# EasyEDA Pro project stm32_无人机.eprj, board PCB2
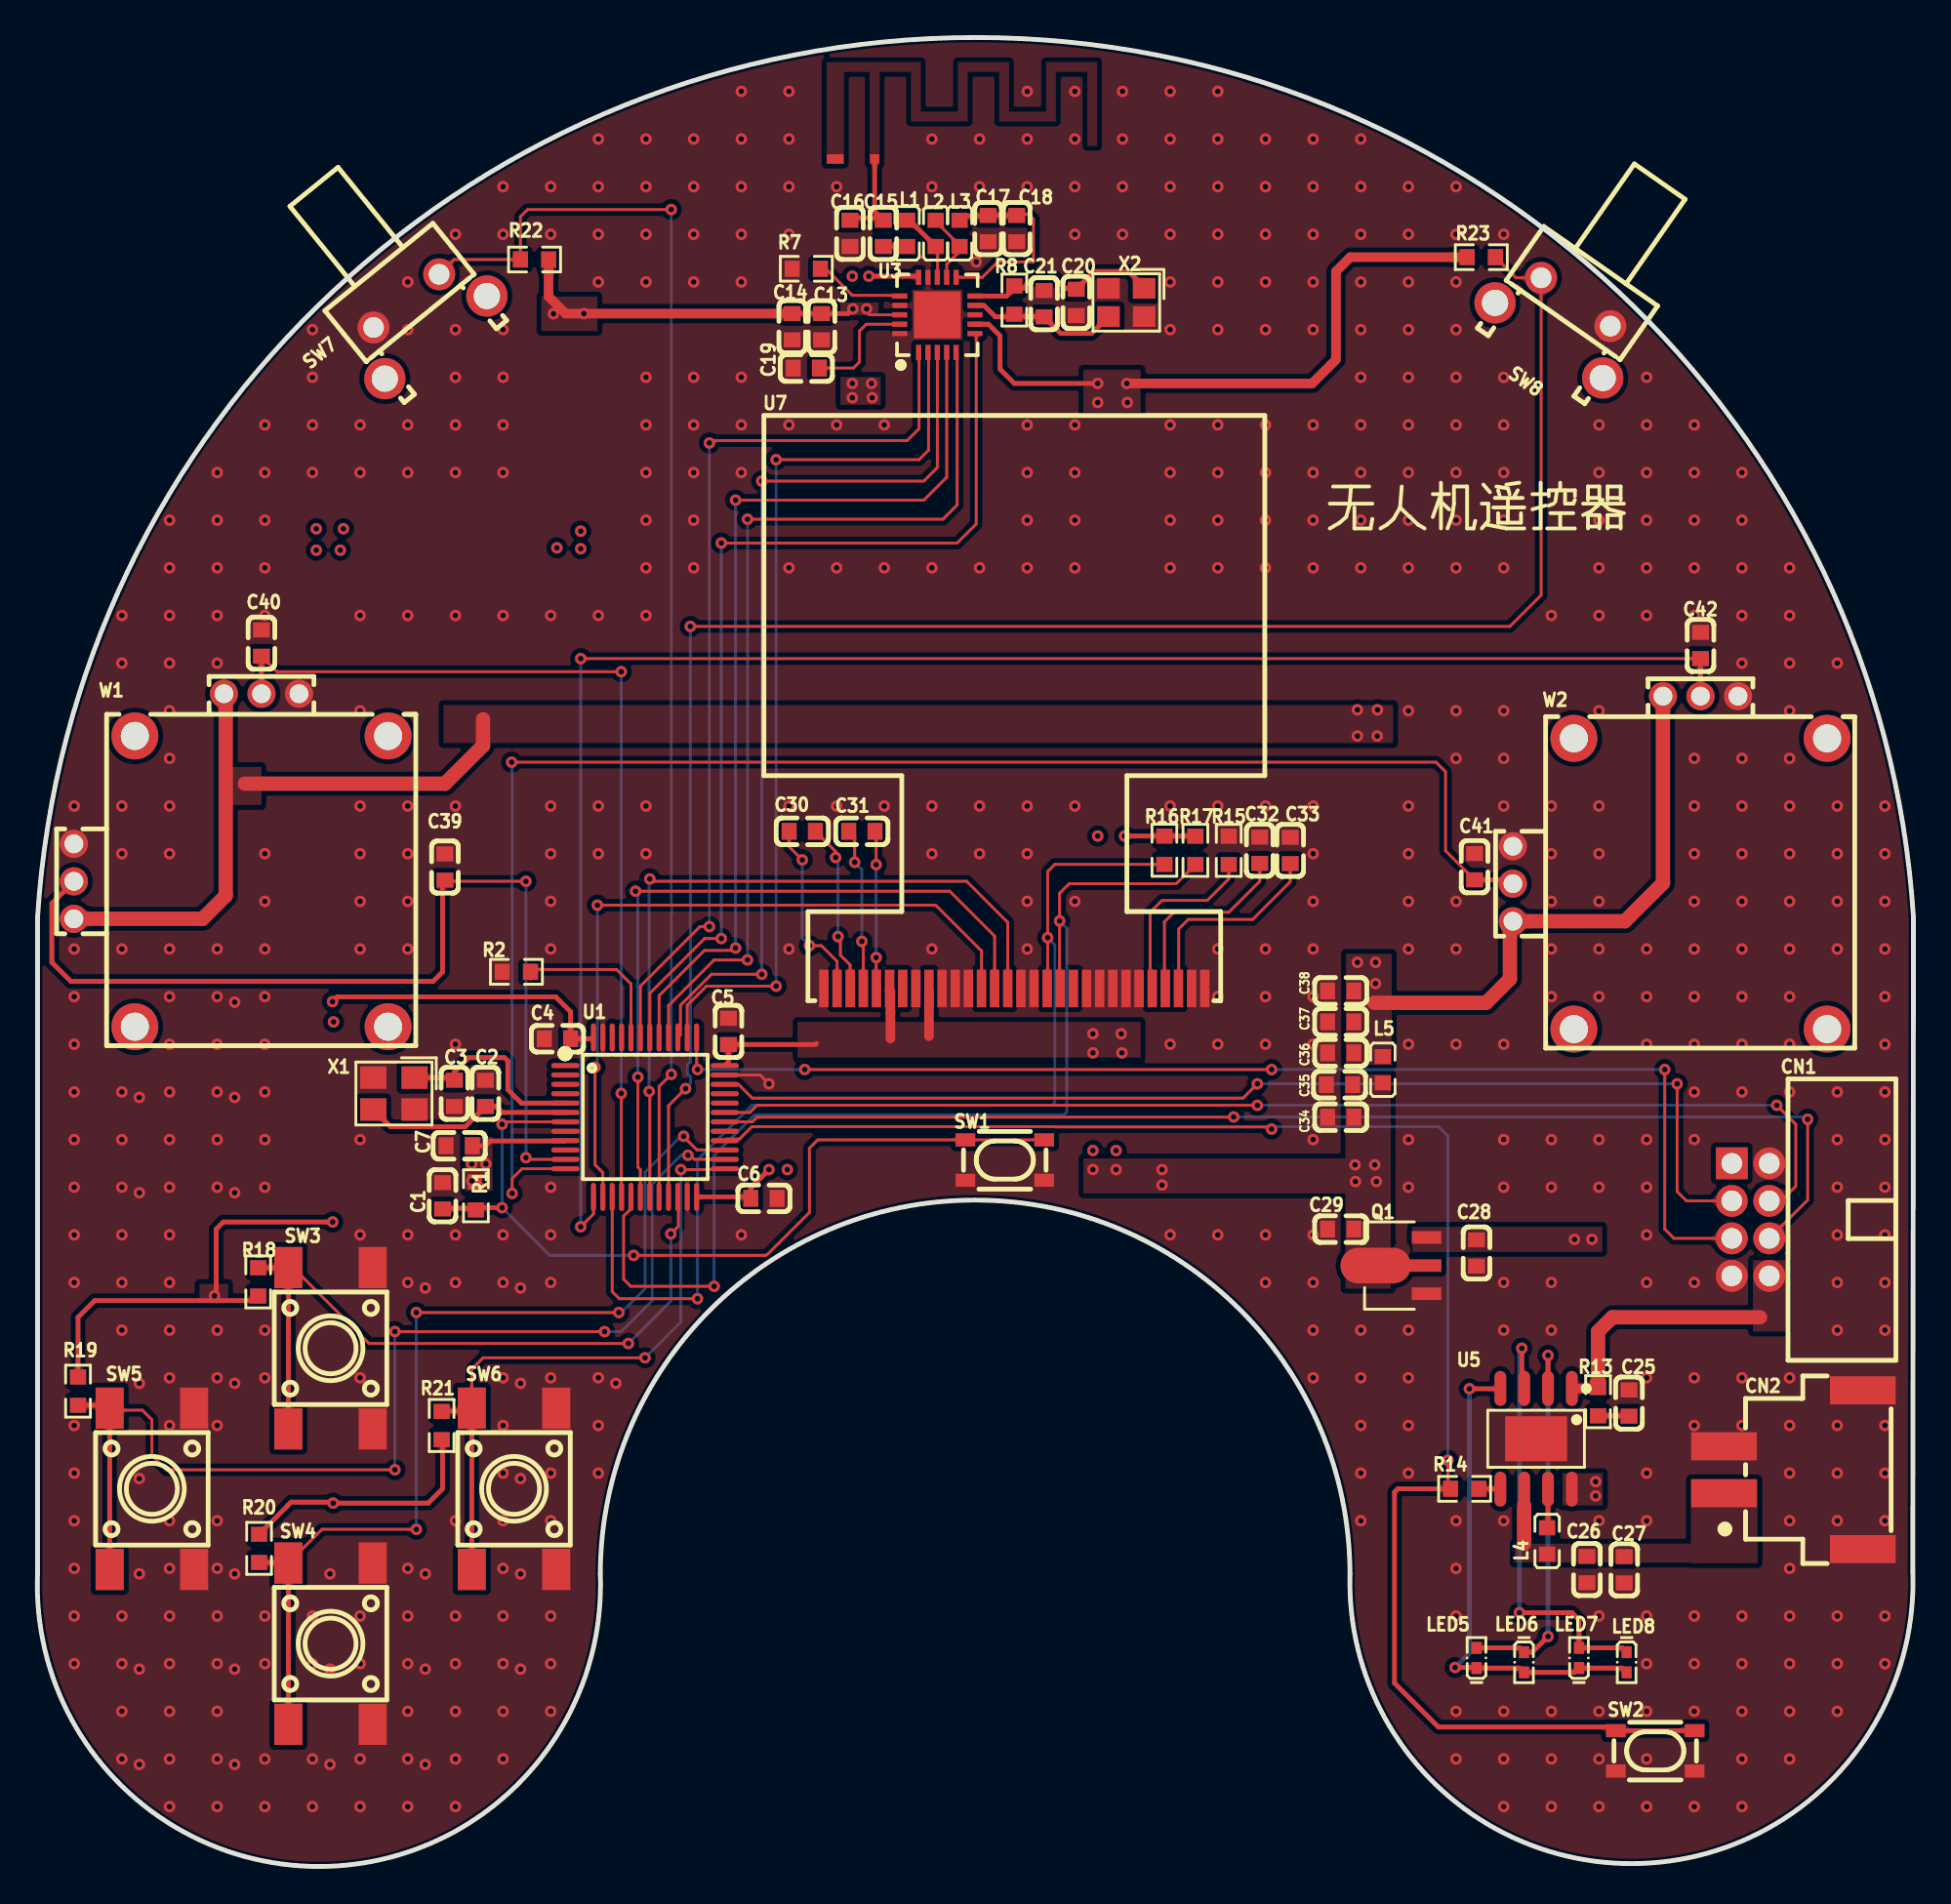
[diagram p13: board, top side]
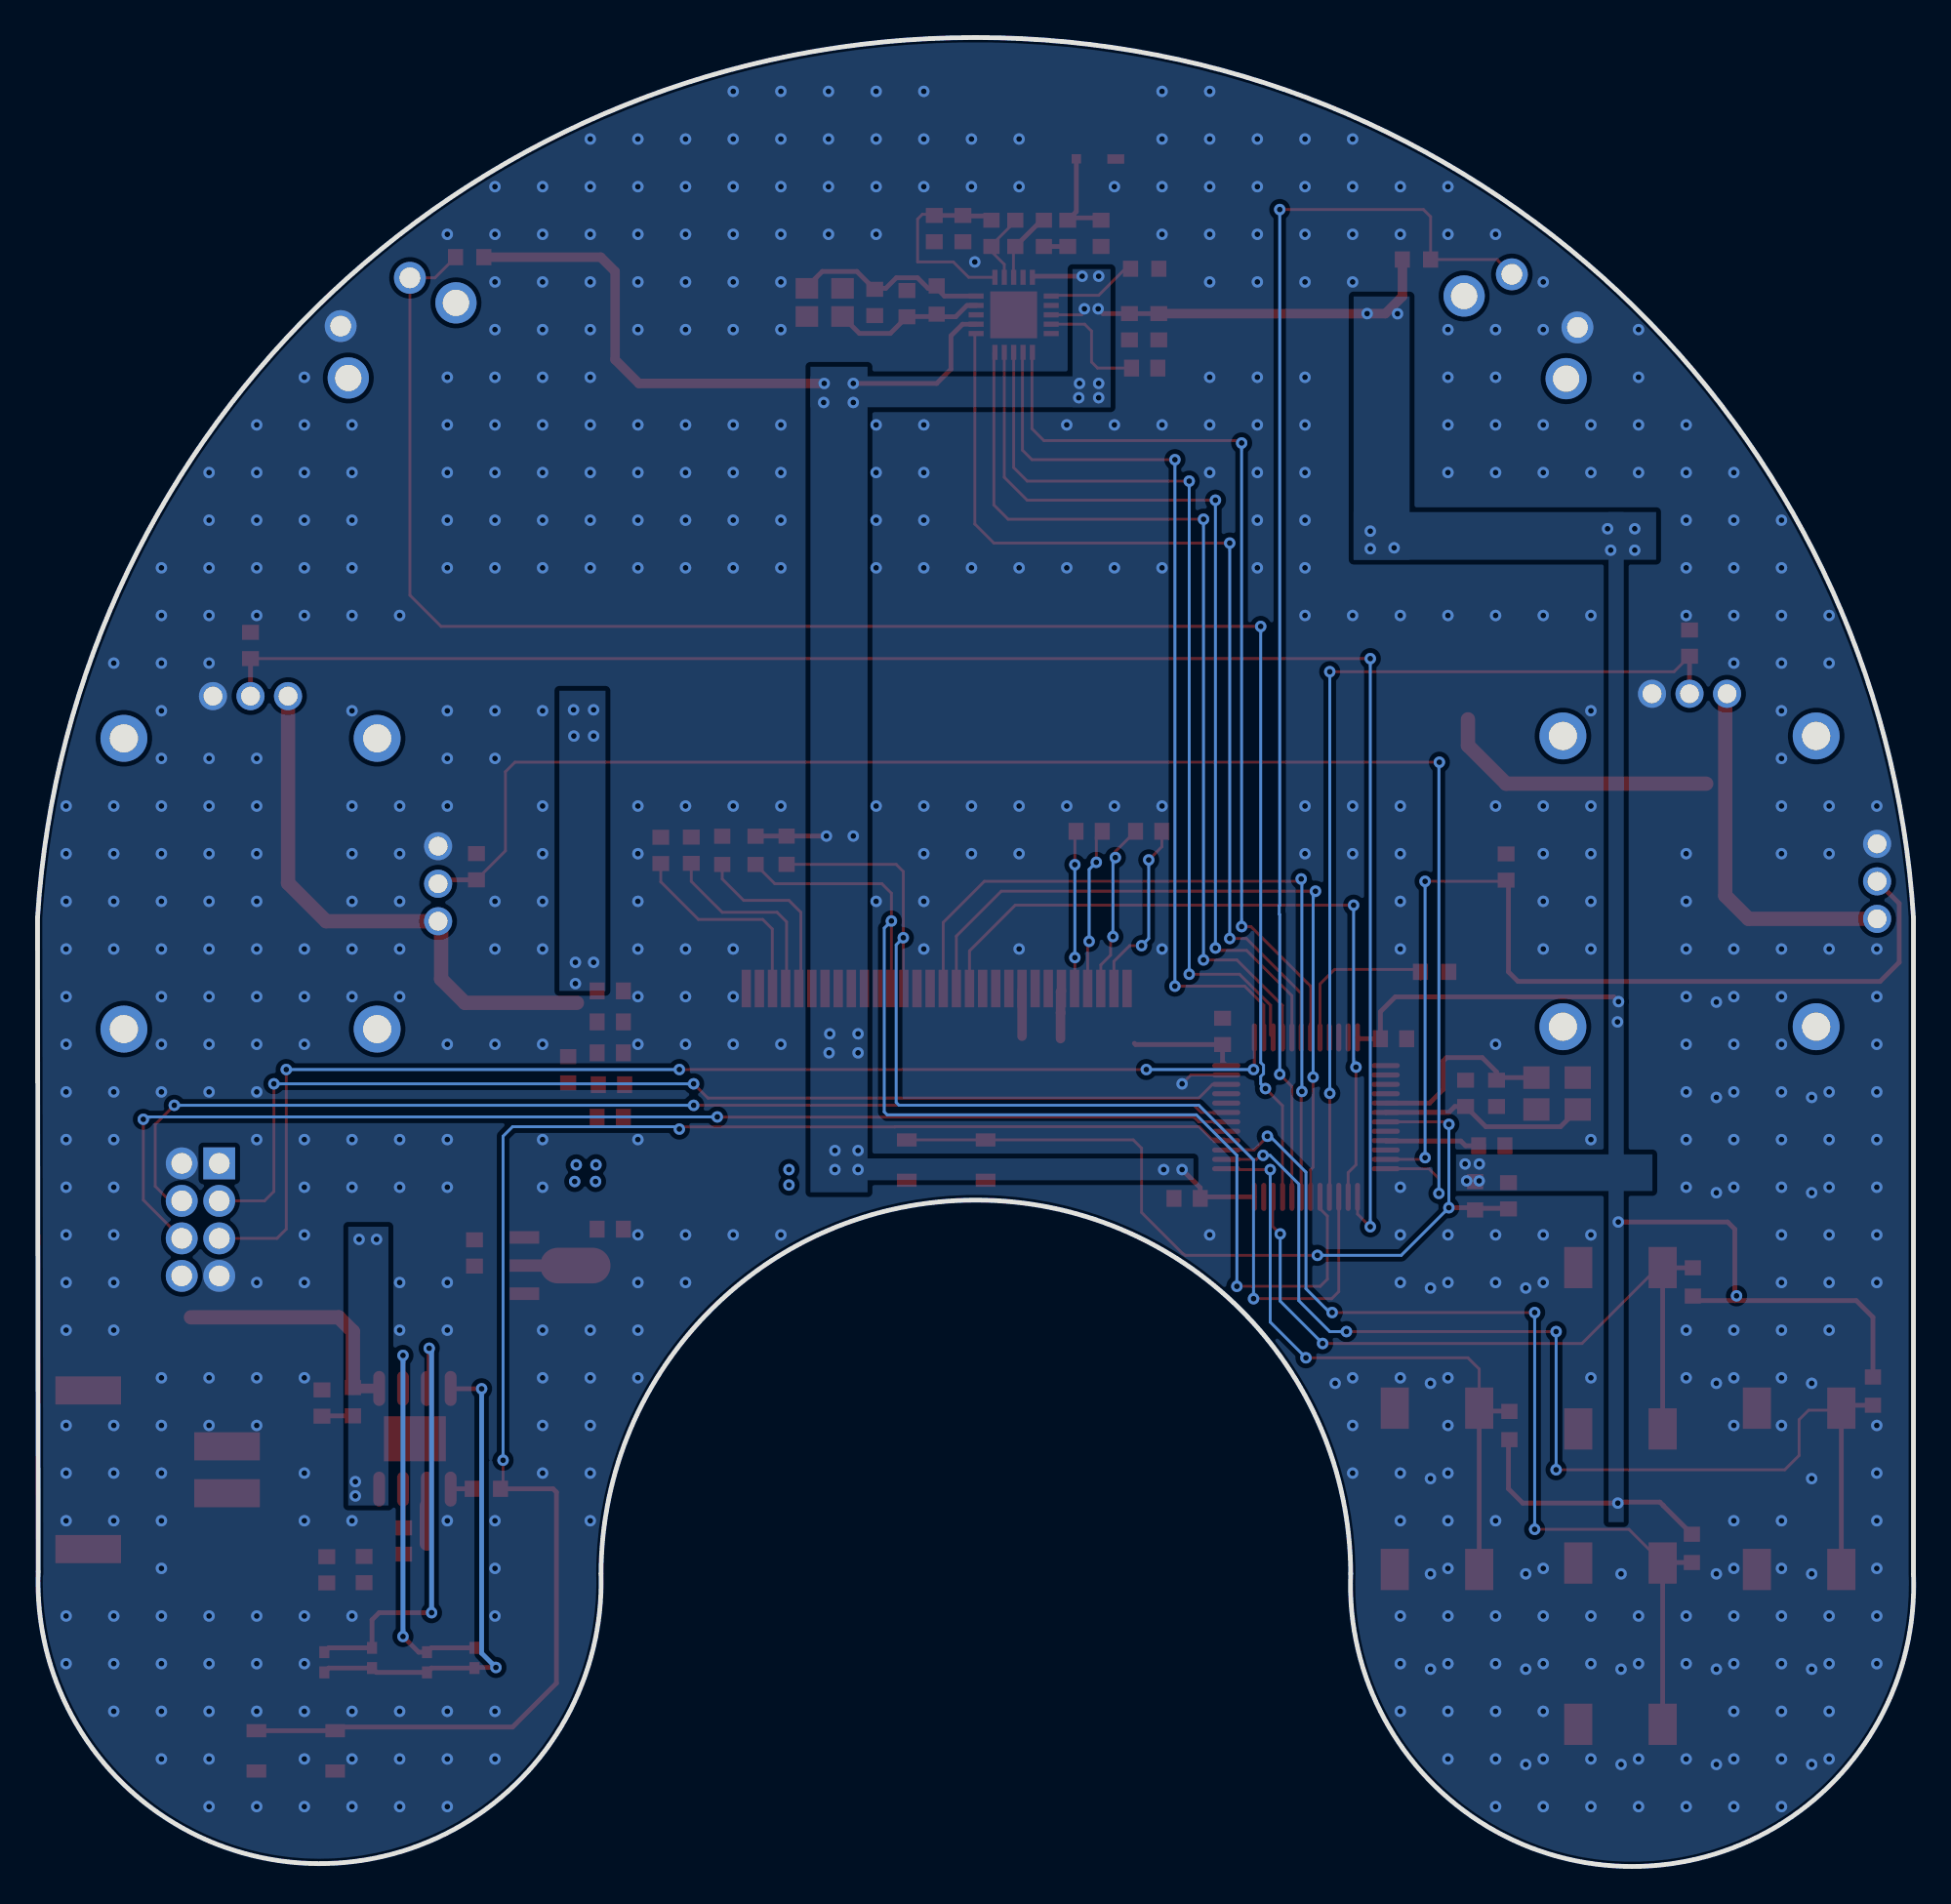
[diagram p14: board, bottom side, seen from below]

Outline 100 x 97.5 mm; copper layers: Top Layer, Bottom Layer. Coordinates in mm from the lower left corner of the outline.
Outline path: 0,50.58 0,15.58 arc(15,0) 30,15.61 arc(50.06,35.54) 69.96,15.61 arc(84.96,0.15) 99.96,15.73 100,50.58 arc(50,97.5) 0,50.58
Stack: Top Layer 0.035mm / Dielectric1 1.51mm FR4 er 4.5 / Bottom Layer 0.035mm

## Design rules (mm)
template: 自定义配置
spacing copperThickness1oz (default): track to track 0.102, other pairs 0.152 to 0.3
spacing copperThickness2oz: track to track 0.203, other pairs 0.152 to 0.3
track width copperThickness1oz (default): min 0.127, default 0.152, max 2.54
track width copperThickness2oz: min 0.203, default 0.254, max 2.54
differential pair differentialPair (default): width min 0.127, default 0.254, max 2.54; gap min 0.152, default 0.152
via viaSize (default): diameter min 0.5, default 0.61, max 10; hole min 0.3, default 0.305, max 6.3

## Placement (name value [footprint] x y rotation side)
C1  100nF  [C0603]  21.59 35.75 270 top
C2  12pF  [C0603]  23.88 41.22 270 top
C3  12pF  [C0603]  22.23 41.22 270 top
C4  100nF  [C0603]  27.72 44.13 0 top
C5  100nF  [C0603]  36.83 44.52 270 top
C6  100nF  [C0603]  38.72 35.62 180 top
C7  100nF  [C0603]  22.48 38.42 0 top
C13  100nF  [C0603]  41.79 82.08 90 top
C14  10uF  [C0603]  40.23 82.08 90 top
C15  1.5pF  [C0603]  45.08 87.06 90 top
C16  1pF  [C0603]  43.31 87.06 90 top
C17  4.7pF  [C0603]  50.67 87.32 90 top
C18  2.2nF  [C0603]  52.2 87.32 90 top
C19  33nF  [C0603]  40.98 79.88 0 top
C20  22pF  [C0603]  55.37 83.38 270 top
C21  22pF  [C0603]  53.66 83.31 270 top
C25  2.2uF  [C0603]  84.84 24.71 90 top
C26  10uF  [C0603]  82.59 15.83 90 top
C27  10uF  [C0603]  84.58 15.82 90 top
C28  10uF  [C0603]  76.71 32.71 90 top
C29  10uF  [C0603]  69.47 33.98 180 top
C30  1uF  [C0603]  40.77 55.19 180 top
C31  1uF  [C0603]  43.94 55.19 0 top
C32  4.7uF  [C0603]  65.15 54.18 270 top
C33  2.2uF  [C0603]  66.77 54.17 270 top
C34  10uF  [C0603]  69.47 39.95 0 top
C35  100nF  [C0603]  69.41 41.68 0 top
C36  1nF  [C0603]  69.47 43.37 0 top
C37  100nF  [C0603]  69.47 45.03 0 top
C38  10uF  [C0603]  69.47 46.68 0 top
C39  100nF  [C0603]  21.72 53.28 270 top
C40  100nF  [C0603]  11.94 65.22 270 top
C41  100nF  [C0603]  76.6 53.3 270 top
C42  100nF  [C0603]  88.65 65.09 270 top
CN1  3111-08RG0BK00T1  [CONN-TH_3111-08RG0BK00T1]  91.31 34.48 270 top
CN2  ZX-XH2.54-2PWT  [CONN-SMD_2P-P2.54_MEGASTAR_ZX-XH2.54-2PWT]  93.6 21.15 90 top
L1  3.9nH  [L0603]  46.36 87.06 270 top
L2  8.2nH  [L0603]  47.88 87.06 270 top
L3  2.7nH  [L0603]  49.15 87.06 90 top
L4  1.5uH  [L0603]  80.47 17.35 270 top
L5  10uH  [L0603]  71.71 42.47 270 top
LED5  XL-1005UYC  [LED0402-FD_YELLOW]  76.71 11.12 270 top
LED6  XL-1005UYC  [LED0402-FD_YELLOW]  79.24 10.89 90 top
LED7  XL-1005UYC  [LED0402-FD_YELLOW]  82.17 11.12 270 top
LED8  XL-1005UYC  [LED0402-FD_YELLOW]  84.71 10.89 90 top
NOREF  -  [Pad_e87]  44.63 91.03 0 top
NOREF#2  -  [Pad_e86]  42.52 91.03 0 top
Q1  AMS1117-3.3V  [SOT-89-3_L4.5-W2.5-P1.50-LS4.2-BR]  72.69 32.03 0 top
R1  10KΩ  [R0603]  23.37 35.75 90 top
R2  10K  [R0603]  25.53 47.69 180 top
R7  22K  [R0603]  40.98 85.17 180 top
R8  1MΩ  [R0603]  52.07 83.51 90 top
R13  1.5Ω  [R0603]  83.19 24.78 270 top
R14  10KΩ  [R0603]  76.07 20.13 180 top
R15  910Ω  [R0603]  63.5 54.17 270 top
R16  10K  [R0603]  60.07 54.18 270 top
R17  10K  [R0603]  61.72 54.17 270 top
R18  10K  [R0603]  11.76 31.16 90 top
R19  10K  [R0603]  2.16 25.34 270 top
R20  10K  [R0603]  11.81 16.96 270 top
R21  10K  [R0603]  21.54 23.51 90 top
R22  10K  [R0603]  26.49 85.67 180 top
R23  10K  [R0603]  76.96 85.79 0 top
SW1  SKRPACE010  [KEY-SMD_4P-L4.2-W3.2-P2.20-LS4.6]  51.56 37.66 0 top
SW2  SKRPACE010  [KEY-SMD_4P-L4.2-W3.2-P2.20-LS4.6]  86.23 6.16 0 top
SW3  TS-1102S-C-M-B  [KEY-SMD_4P-L6.0-W6.0-P4.50-LS8.6_TS-1102S-C-M-B]  15.62 27.63 90 top
SW4  TS-1102S-C-M-B  [KEY-SMD_4P-L6.0-W6.0-P4.50-LS8.6_TS-1102S-C-M-B]  15.62 11.88 90 top
SW5  TS-1102S-C-M-B  [KEY-SMD_4P-L6.0-W6.0-P4.50-LS8.6_TS-1102S-C-M-B]  6.1 20.13 90 top
SW6  TS-1102S-C-M-B  [KEY-SMD_4P-L6.0-W6.0-P4.50-LS8.6_TS-1102S-C-M-B]  25.4 20.13 90 top
SW7  UK-B02124G90-AQ25Y  [SW-TH_UK-B02124G90-AQ25Y]  20.45 82.49 219 top
SW8  UK-B02124G90-AQ25Y  [SW-TH_UK-B02124G90-AQ25Y]  81.28 82.38 145.1 top
U1  STM32F103C8T6  [LQFP-48_L7.0-W7.0-P0.50-LS9.0-BL]  32.39 39.95 270 top
U3  Si24R1  [QFN-20_L4.0-W4.0-P0.50-BL-EP]  47.97 82.72 0 top
U5  TP4336  [ESOP-8_L4.9-W3.9-P1.27-LS6.0-BL-EP-1]  79.88 22.8 180 top
U7  X096-2864KSWAG01-H30  [LCD-SMD_X096-2864KSWAG01-H30]  52.07 46.8 0 top
W1  -  [16*16双路]  11.94 52.52 0 top
W2  -  [16*16双路]  88.65 52.39 0 top
X1  8MHz  [CRYSTAL-SMD_4P-L3.2-W2.5-BL]  19 41.21 180 top
X2  -  [CRYSTAL-SMD_4P-L2.5-W2.0-BL-2]  58.04 83.38 180 top

## Footprints (pads in the part's own frame, mm; a bottom-side part is the same pattern mirrored in y, then rotated)
16*16双路
  round 1.5 hole 1: 1(-10,2) 2(-10,0) 3(-10,-2) 4(-2,10) 5(0,10) 6(2,10)
  round 2.5 hole 1.5: 7(-6.75,-7.75) 8(6.75,-7.75) 9(6.75,7.75) 10(-6.75,7.75)
C0603
  rect 0.8x0.9 smd: 1(-0.7,0) 2(0.7,0)
CONN-SMD_2P-P2.54_MEGASTAR_ZX-XH2.54-2PWT
  rect 1.5x3.5 smd: 1(-1.25,3.7) 2(1.25,3.7) 3(-4.23,-3.7) 4(4.23,-3.7)
CONN-TH_3111-08RG0BK00T1
  rect 1.7x1.7 hole 1.1: 1(-3,-1)
  round 1.7 hole 1.1: 2(-3,1) 3(-1,-1) 4(-1,1) 5(1,-1) 6(1,1) 7(3,-1) 8(3,1)
CRYSTAL-SMD_4P-L2.5-W2.0-BL-2
  rect 1.2x1.1 smd: 1(-0.95,-0.75) 2(0.95,-0.75) 3(0.95,0.75) 4(-0.95,0.75)
CRYSTAL-SMD_4P-L3.2-W2.5-BL
  rect 1.4x1.2 smd: 1(-1.1,-0.85) 2(1.1,-0.85) 3(1.1,0.85) 4(-1.1,0.85)
ESOP-8_L4.9-W3.9-P1.27-LS6.0-BL-EP-1
  oval 0.63x1.865 smd: 1(-1.905,-2.683) 2(-0.635,-2.683) 3(0.635,-2.683) 4(1.905,-2.683) 5(1.905,2.683) 6(0.635,2.683) 7(-0.635,2.683) 8(-1.905,2.683)
  rect 3.3x2.4 smd: 9(0,0)
KEY-SMD_4P-L4.2-W3.2-P2.20-LS4.6
  rect 1.05x0.7 smd: 1(-2.1,1.075) 2(2.1,1.075) 3(-2.1,-1.075) 4(2.1,-1.075)
KEY-SMD_4P-L6.0-W6.0-P4.50-LS8.6_TS-1102S-C-M-B
  rect 2.2x1.5 smd: 1(-4.3,2.25) 2(4.3,2.25) 3(-4.3,-2.25) 4(4.3,-2.25)
L0603
  rect 0.8x0.864 smd: 1(-0.7,0) 2(0.7,0)
LCD-SMD_X096-2864KSWAG01-H30
  rect 0.5x2 smd: 1(-10.15,0) 2(-9.45,0) 3(-8.75,0) 4(-8.05,0) 5(-7.35,0) 6(-6.65,0) 7(-5.95,0) 8(-5.25,0) 9(-4.55,0) 10(-3.85,0) 11(-3.15,0) 12(-2.45,0) 13(-1.75,0) 14(-1.05,0) 15(-0.35,0) 16(0.35,0) 17(1.05,0) 18(1.75,0) 19(2.45,0) 20(3.15,0) 21(3.85,0) 22(4.55,0) 23(5.25,0) 24(5.95,0) 25(6.65,0) 26(7.35,0) 27(8.05,0) 28(8.75,0) 29(9.45,0) 30(10.15,0)
LED0402-FD_YELLOW
  rect 0.636x0.54 smd: 1(-0.538,0) 2(0.538,0)
LQFP-48_L7.0-W7.0-P0.50-LS9.0-BL
  oval 0.27x1.5 smd: 1(-2.75,-4.25) 2(-2.25,-4.25) 3(-1.75,-4.25) 4(-1.25,-4.25) 5(-0.75,-4.25) 6(-0.25,-4.25) 7(0.25,-4.25) 8(0.75,-4.25) 9(1.25,-4.25) 10(1.75,-4.25) 11(2.25,-4.25) 12(2.75,-4.25) 25(2.75,4.25) 26(2.25,4.25) 27(1.75,4.25) 28(1.25,4.25) 29(0.75,4.25) 30(0.25,4.25) 31(-0.25,4.25) 32(-0.75,4.25) 33(-1.25,4.25) 34(-1.75,4.25) 35(-2.25,4.25) 36(-2.75,4.25)
  oval 1.5x0.27 smd: 13(4.25,-2.75) 14(4.25,-2.25) 15(4.25,-1.75) 16(4.25,-1.25) 17(4.25,-0.75) 18(4.25,-0.25) 19(4.25,0.25) 20(4.25,0.75) 21(4.25,1.25) 22(4.25,1.75) 23(4.25,2.25) 24(4.25,2.75) 37(-4.25,2.75) 38(-4.25,2.25) 39(-4.25,1.75) 40(-4.25,1.25) 41(-4.25,0.75) 42(-4.25,0.25) 43(-4.25,-0.25) 44(-4.25,-0.75) 45(-4.25,-1.25) 46(-4.25,-1.75) 47(-4.25,-2.25) 48(-4.25,-2.75)
Pad_e86
  rect 0.9x0.5 smd: 2(0,0)
Pad_e87
  rect 0.5x0.5 smd: 1(0,0)
QFN-20_L4.0-W4.0-P0.50-BL-EP
  rect 0.28x0.8 smd: 1(-1,-2) 2(-0.5,-2) 3(0,-2) 4(0.5,-2) 5(1,-2) 11(1,2) 12(0.5,2) 13(0,2) 14(-0.5,2) 15(-1,2)
  rect 0.8x0.28 smd: 6(2,-1) 7(2,-0.5) 8(2,0) 9(2,0.5) 10(2,1) 16(-2,1) 17(-2,0.5) 18(-2,0) 19(-2,-0.5) 20(-2,-1)
  rect 2.5x2.5 smd: 21(0,0)
R0603
  rect 0.806x0.864 smd: 1(-0.753,0) 2(0.753,0)
SOT-89-3_L4.5-W2.5-P1.50-LS4.2-BR
  rect 1.575x0.672 smd: 1(1.356,-1.5) 3(1.356,1.5)
  custom 5.377x1.9 smd: 2(-1.356,0)
SW-TH_UK-B02124G90-AQ25Y
  round 1.7 hole 1.1: 1(-2.25,-1.25) 2(2.25,-1.25)
  round 2.2 hole 1.4: 3(-3.5,1.25) 4(3.5,1.25)

## Nets
As in the schematic, except:
AT1: C15.2 C16.2 NOREF.1 NOREF#2.2
$1N1208: R2.1 U1.44

Pads without a net: CN1 1; SW7 3 4; SW8 3 4; U1 1 2 3 4 10 29 32 33 45 46; U7 7 20; W1 7 8 9 10; W2 7 8 9 10

## Via types
v1: diameter 0.61, hole 0.305, Top Layer to Bottom Layer, 724 vias

## Routing (per net, layer and track width the routed paths; a pad name or vN(x,y) marks a point on that pad's centre or on a via; arc(x,y) is an arc through that point)
3V3: length 133.2
  Top Layer w0.152: U3.18 44.32,82.72
  Top Layer w0.254: R19.1 2.16,29.28 3.05,30.17 9.53,30.17 ; 9.53,30.17 11.52,30.17 R18.1 ; 9.53,30.17 9.53,33.98 9.91,34.36 v1(15.74,34.36) ; C14.2 C13.2 43.21,82.78 v1(43.46,83.04) ; U1.24 37.94,35.7 C6.2 38.02,36.18 v1(38.99,37.15) ; R17.1 61.72,54.93 R16.1 ; U3.7 50.69,82.22 51.31,81.6 51.31,79.82 52.07,79.06 v1(56.52,79.06) ; U1.36 36.83,42.89 C5.2 41.46,43.82 41.53,43.88 ; U1.48 29.57,44.13 C4.2 28.42,45.57 27.62,46.36 15.98,46.36 v1(15.72,46.11) ; v1(57.95,54.93) 60.07,54.93 ; v1(44.31,84.78) 46.91,84.78 U3.15 ; R20.1 13.34,19.24 13.34,19.24 13.51,19.42 15.71,19.42 v1(15.76,19.37) 20.83,19.37 21.59,20.13 21.59,22.71 R21.1 ; 22.93,38.42 23.88,38.42 24.13,38.68 28.12,38.68 U1.9
  Top Layer w0.508: 47.52,46.68 47.52,44.26 ; 45.42,46.68 45.46,46.63 45.46,45.51 45.47,45.51 45.47,44.14 ; C14.2 v1(29.12,82.78) 28.15,82.78 27.24,83.7 27.24,85.66 R22.1 ; R23.1 69.98,85.79 69.22,85.03 69.22,80.33 67.95,79.06 v1(58.07,79.06)
  vias: v1(9.43,30.42) v1(14.86,71.31) v1(14.86,70.17) v1(15.78,45.03) v1(16.14,70.17) v1(16.31,71.31) v1(23.14,37.45) v1(23.15,36.55) v1(23.9,37.45) v1(23.82,36.55) v1(27.5,82.78) v1(27.69,70.3) v1(28.96,71.19) v1(28.96,70.25) v1(39.97,37.15) v1(43.43,84.78) v1(43.43,79.06) v1(43.43,78.3) v1(44.2,83.04) v1(44.46,79.06) v1(44.5,78.3) v1(56.26,44.39) v1(56.26,43.37) v1(56.26,38.17) v1(56.26,37.15) v1(56.52,78.05) v1(56.52,54.93) v1(57.49,38.17) v1(57.49,37.15) v1(57.77,44.39) v1(57.81,43.37) v1(58.09,78.05) v1(59.94,37.15) v1(59.94,36.33) v1(70.23,37.41) v1(70.25,36.52) v1(71.28,37.41) v1(71.37,36.52)
3V3A: length 64.1
  Top Layer w0.762: W1.3 8.8,50.52 10.03,51.76 10.03,62.52 10.03,62.52 W1.4 ; 11.05,57.73 21.72,57.73 23.75,59.76 23.75,61.15 ; W2.4 86.65,52.42 84.61,50.39 W2.3 78.49,50.23 78.49,47.31 77.22,46.04 71.25,46.04
  vias: v1(70.36,61.66) v1(70.36,60.27) v1(70.36,48.2) v1(71.33,48.2) v1(71.33,47.07) v1(71.43,61.66) v1(71.41,60.27)
+5V:
  vias: v1(81.93,33.43) v1(82.86,33.43) v1(83.06,20.52) v1(83.06,19.75)
GND: length 2.5
  Top Layer w0.152: U1.35 38.52,42.2 v1(38.99,41.72)
  vias: v1(1.96,56.53) v1(1.96,48.91) v1(1.96,46.37) v1(1.96,43.83) v1(1.96,41.29) v1(1.96,38.75) v1(1.96,36.21) v1(1.96,33.67) v1(1.96,31.13) v1(1.96,23.51) v1(1.96,20.97) v1(1.96,18.43) v1(1.96,15.89) v1(1.96,13.35) v1(1.96,10.81) v1(4.5,66.69) v1(4.5,64.15) v1(4.5,56.53) v1(4.5,53.99) v1(4.5,48.91) v1(4.5,41.29) v1(4.5,38.75) v1(4.5,36.21) v1(4.5,33.67) v1(4.5,31.13) v1(4.5,28.59) v1(4.5,13.35) v1(4.5,10.81) v1(4.5,8.27) v1(4.5,5.73) v1(5.43,41) v1(5.43,35.92) v1(5.43,25.76) v1(5.43,20.68) v1(5.43,15.6) v1(5.43,10.52) v1(5.43,5.44) v1(7.04,71.77) v1(7.04,69.23) v1(7.04,66.69) v1(7.04,64.15) v1(7.04,61.61) v1(7.04,59.07) v1(7.04,56.53) v1(7.04,53.99) v1(7.04,48.91) v1(7.04,46.37) v1(7.04,43.83) v1(7.04,41.29) v1(7.04,38.75) v1(7.04,36.21) v1(7.04,33.67) v1(7.04,31.13) v1(7.04,28.59) v1(7.04,26.05) v1(7.04,23.51) v1(7.04,18.43) v1(7.04,15.89) v1(7.04,13.35) v1(7.04,10.81) v1(7.04,8.27) v1(7.04,5.73) v1(7.04,3.19) v1(9.58,74.31) v1(9.58,71.77) v1(9.58,69.23) v1(9.58,66.69) v1(9.58,64.15) v1(9.58,48.91) v1(9.58,46.37) v1(9.58,43.83) v1(9.58,41.29) v1(9.58,38.75) v1(9.58,36.21) v1(9.58,28.59) v1(9.58,26.05) v1(9.58,23.51) v1(9.58,18.43) v1(9.58,15.89) v1(9.58,13.35) v1(9.58,10.81) v1(9.58,8.27) v1(9.58,5.73) v1(9.58,3.19) v1(10.51,46.08) v1(10.51,41) v1(10.51,35.92) v1(10.51,25.76) v1(10.51,15.6) v1(10.51,10.52) v1(10.51,5.44) v1(12.12,76.85) v1(12.12,74.31) v1(12.12,71.77) v1(12.12,69.23) v1(12.12,66.69) v1(12.12,53.99) v1(12.12,51.45) v1(12.12,48.91) v1(12.12,46.37) v1(12.12,43.83) v1(12.12,41.29) v1(12.12,38.75) v1(12.12,36.21) v1(12.12,28.59) v1(12.12,26.05) v1(12.12,13.35) v1(12.12,10.81) v1(12.12,5.73) v1(12.12,3.19) v1(14.66,81.93) v1(14.66,79.39) v1(14.66,76.85) v1(14.66,74.31) v1(14.66,13.35) v1(14.66,10.81) v1(14.66,5.73) v1(14.66,3.19) v1(15.59,15.6) v1(15.59,10.52) v1(15.59,5.44) v1(17.2,76.85) v1(17.2,74.31) v1(17.2,66.69) v1(17.2,61.61) v1(17.2,56.53) v1(17.2,53.99) v1(17.2,51.45) v1(17.2,48.91) v1(17.2,38.75) v1(17.2,33.67) v1(17.2,26.05) v1(17.2,13.35) v1(17.2,10.81) v1(17.2,5.73) v1(17.2,3.19) v1(19.74,84.47) v1(19.74,81.93) v1(19.74,76.85) v1(19.74,74.31) v1(19.74,66.69) v1(19.74,56.53) v1(19.74,53.99) v1(19.74,51.45) v1(19.74,48.91) v1(19.74,33.67) v1(19.74,31.13) v1(19.74,15.89) v1(19.74,13.35) v1(19.74,10.81) v1(19.74,8.27) v1(19.74,5.73) v1(19.74,3.19) v1(20.67,30.84) v1(20.67,15.6) v1(20.67,10.52) v1(20.67,5.44) v1(22.28,87.01) v1(22.28,81.93) v1(22.28,79.39) v1(22.28,76.85) v1(22.28,74.31) v1(22.28,66.69) v1(22.28,56.53) v1(22.28,43.83) v1(22.28,33.67) v1(22.28,31.13) v1(22.28,18.43) v1(22.28,13.35) v1(22.28,10.81) v1(22.28,8.27) v1(22.28,5.73) v1(22.28,3.19) v1(24.82,89.55) v1(24.82,87.01) v1(24.82,81.93) v1(24.82,79.39) v1(24.82,76.85) v1(24.82,74.31) v1(24.82,66.69) v1(24.82,33.67) v1(24.82,31.13) v1(24.82,26.05) v1(24.82,23.51) v1(24.82,20.97) v1(24.82,18.43) v1(24.82,15.89) v1(24.82,13.35) v1(24.82,10.81) v1(24.82,8.27) v1(24.82,5.73) v1(25.75,30.84) v1(25.75,25.76) v1(25.75,20.68) v1(25.75,15.6) v1(25.75,10.52) v1(27.36,89.55) v1(27.36,87.01) v1(27.36,66.69) v1(27.36,56.53) v1(27.36,53.99) v1(27.36,51.45) v1(27.36,48.91) v1(27.36,36.21) v1(27.36,33.67) v1(27.36,31.13) v1(27.36,26.05) v1(27.36,20.97) v1(27.36,18.43) v1(27.36,13.35) v1(27.36,10.81) v1(27.36,8.27) v1(29.9,92.09) v1(29.9,89.55) v1(29.9,87.01) v1(29.9,84.47) v1(29.9,66.69) v1(29.9,56.53) v1(29.9,53.99) v1(29.9,26.05) v1(29.9,23.51) v1(29.9,20.97) v1(30.83,25.76) v1(32.44,92.09) v1(32.44,89.55) v1(32.44,87.01) v1(32.44,84.47) v1(32.44,79.39) v1(32.44,76.85) v1(32.44,74.31) v1(32.44,71.77) v1(32.44,69.23) v1(32.44,66.69) v1(32.44,56.53) v1(32.44,53.99) v1(34.98,92.09) v1(34.98,89.55) v1(34.98,87.01) v1(34.98,84.47) v1(34.98,79.39) v1(34.98,76.85) v1(34.98,74.31) v1(34.98,71.77) v1(34.98,69.23) v1(37.52,94.63) v1(37.52,92.09) v1(37.52,89.55) v1(37.52,87.01) v1(37.52,84.47) v1(37.52,79.39) v1(37.52,76.85) v1(37.52,74.31) v1(37.52,33.67) v1(40.06,94.63) v1(40.06,92.09) v1(40.06,89.55) v1(40.06,87.01) v1(40.06,76.85) v1(40.06,69.23) v1(40.06,56.53) v1(40.06,48.91) v1(42.6,89.55) v1(42.6,76.85) v1(42.6,69.23) v1(42.6,56.53) v1(45.14,76.85) v1(45.14,69.23) v1(45.14,56.53) v1(47.68,92.09) v1(47.68,89.55) v1(47.68,69.23) v1(47.68,56.53) v1(47.68,53.99) v1(47.68,48.91) v1(50.04,85.54) v1(50.22,92.09) v1(50.22,89.55) v1(50.22,69.23) v1(50.22,56.53) v1(50.22,53.99) v1(52.76,94.63) v1(52.76,92.09) v1(52.76,89.55) v1(52.76,76.85) v1(52.76,74.31) v1(52.76,71.77) v1(52.76,69.23) v1(52.76,56.53) v1(52.76,53.99) v1(52.76,51.45) v1(52.76,48.91) v1(55.3,94.63) v1(55.3,92.09) v1(55.3,89.55) v1(55.3,87.01) v1(55.3,76.85) v1(55.3,74.31) v1(55.3,71.77) v1(55.3,69.23) v1(55.3,56.53) v1(55.3,51.45) v1(57.84,94.63) v1(57.84,92.09) v1(57.84,89.55) v1(57.84,87.01) v1(60.38,94.63) v1(60.38,92.09) v1(60.38,89.55) v1(60.38,87.01) v1(60.38,84.47) v1(60.38,81.93) v1(60.38,76.85) v1(60.38,74.31) v1(60.38,71.77) v1(60.38,69.23) v1(60.38,56.53) v1(60.38,43.83) v1(60.38,33.67) v1(62.92,94.63) v1(62.92,92.09) v1(62.92,89.55) v1(62.92,87.01) v1(62.92,84.47) v1(62.92,81.93) v1(62.92,76.85) v1(62.92,74.31) v1(62.92,71.77) v1(62.92,69.23) v1(62.92,56.53) v1(62.92,48.91) v1(62.92,46.37) v1(62.92,43.83) v1(62.92,33.67) v1(65.46,92.09) v1(65.46,89.55) v1(65.46,87.01) v1(65.46,84.47) v1(65.46,81.93) v1(65.46,76.85) v1(65.46,74.31) v1(65.46,71.77) v1(65.46,69.23) v1(65.46,56.53) v1(65.46,48.91) v1(65.46,46.37) v1(65.46,43.83) v1(65.46,33.67) v1(65.46,31.13) v1(68,92.09) v1(68,89.55) v1(68,87.01) v1(68,84.47) v1(68,81.93) v1(68,76.85) v1(68,74.31) v1(68,71.77) v1(68,69.23) v1(68,56.53) v1(68,53.99) v1(68,51.45) v1(68,48.91) v1(68,46.37) v1(68,43.83) v1(68,38.75) v1(68,33.67) v1(68,31.13) v1(68,28.59) v1(68,26.05) v1(70.54,92.09) v1(70.54,89.55) v1(70.54,87.01) v1(70.54,84.47) v1(70.54,81.93) v1(70.54,79.39) v1(70.54,76.85) v1(70.54,74.31) v1(70.54,71.77) v1(70.54,69.23) v1(70.54,28.59) v1(70.54,26.05) v1(70.54,23.51) v1(70.54,20.97) v1(70.54,18.43) v1(73.08,89.55) v1(73.08,87.01) v1(73.08,84.47) v1(73.08,81.93) v1(73.08,79.39) v1(73.08,76.85) v1(73.08,74.31) v1(73.08,71.77) v1(73.08,69.23) v1(73.08,61.61) v1(73.08,56.53) v1(73.08,53.99) v1(73.08,51.45) v1(73.08,48.91) v1(73.08,43.83) v1(73.08,38.75) v1(73.08,36.21) v1(73.08,28.59) v1(73.08,26.05) v1(73.08,23.51) v1(73.08,20.97) v1(75.62,89.55) v1(75.62,87.01) v1(75.62,84.47) v1(75.62,81.93) v1(75.62,79.39) v1(75.62,76.85) v1(75.62,74.31) v1(75.62,71.77) v1(75.62,69.23) v1(75.62,61.61) v1(75.62,59.07) v1(75.62,51.45) v1(75.62,48.91) v1(75.62,43.83) v1(75.62,18.43) v1(75.62,15.89) v1(75.62,13.35) v1(75.62,8.27) v1(75.62,5.73) v1(78.16,87.01) v1(78.16,79.39) v1(78.16,76.85) v1(78.16,74.31) v1(78.16,71.77) v1(78.16,69.23) v1(78.16,61.61) v1(78.16,59.07) v1(78.16,56.53) v1(78.16,43.83) v1(78.16,38.75) v1(78.16,36.21) v1(78.16,31.13) v1(78.16,28.59) v1(78.16,18.43) v1(78.16,8.27) v1(78.16,5.73) v1(78.16,3.19) v1(80.7,66.69) v1(80.7,56.53) v1(80.7,53.99) v1(80.7,51.45) v1(80.7,48.91) v1(80.7,46.37) v1(80.7,38.75) v1(80.7,36.21) v1(80.7,31.13) v1(80.7,28.59) v1(80.7,8.27) v1(80.7,5.73) v1(80.7,3.19) v1(83.24,76.85) v1(83.24,74.31) v1(83.24,71.77) v1(83.24,69.23) v1(83.24,66.69) v1(83.24,61.61) v1(83.24,56.53) v1(83.24,53.99) v1(83.24,51.45) v1(83.24,48.91) v1(83.24,46.37) v1(83.24,38.75) v1(83.24,36.21) v1(83.24,18.43) v1(83.24,13.35) v1(83.24,8.27) v1(83.24,5.73) v1(83.24,3.19) v1(85.78,79.39) v1(85.78,76.85) v1(85.78,74.31) v1(85.78,71.77) v1(85.78,69.23) v1(85.78,66.69) v1(85.78,48.91) v1(85.78,46.37) v1(85.78,43.83) v1(85.78,38.75) v1(85.78,36.21) v1(85.78,33.67) v1(85.78,31.13) v1(85.78,26.05) v1(85.78,20.97) v1(85.78,18.43) v1(85.78,13.35) v1(85.78,10.81) v1(85.78,8.27) v1(85.78,5.73) v1(85.78,3.19) v1(88.32,76.85) v1(88.32,74.31) v1(88.32,71.77) v1(88.32,69.23) v1(88.32,66.69) v1(88.32,59.07) v1(88.32,56.53) v1(88.32,53.99) v1(88.32,51.45) v1(88.32,48.91) v1(88.32,46.37) v1(88.32,43.83) v1(88.32,41.29) v1(88.32,38.75) v1(88.32,31.13) v1(88.32,26.05) v1(88.32,23.51) v1(88.32,13.35) v1(88.32,10.81) v1(88.32,8.27) v1(88.32,3.19) v1(90.86,74.31) v1(90.86,71.77) v1(90.86,69.23) v1(90.86,66.69) v1(90.86,64.15) v1(90.86,59.07) v1(90.86,56.53) v1(90.86,53.99) v1(90.86,51.45) v1(90.86,48.91) v1(90.86,46.37) v1(90.86,43.83) v1(90.86,41.29) v1(90.86,26.05) v1(90.86,23.51) v1(90.86,13.35) v1(90.86,10.81) v1(90.86,8.27) v1(90.86,5.73) v1(90.86,3.19) v1(93.4,69.23) v1(93.4,66.69) v1(93.4,64.15) v1(93.4,61.61) v1(93.4,59.07) v1(93.4,56.53) v1(93.4,53.99) v1(93.4,51.45) v1(93.4,48.91) v1(93.4,46.37) v1(93.4,43.83) v1(93.4,41.29) v1(93.4,26.05) v1(93.4,23.51) v1(93.4,20.97) v1(93.4,18.43) v1(93.4,15.89) v1(93.4,13.35) v1(93.4,10.81) v1(93.4,8.27) v1(93.4,5.73) v1(95.94,64.15) v1(95.94,56.53) v1(95.94,53.99) v1(95.94,51.45) v1(95.94,48.91) v1(95.94,41.29) v1(95.94,38.75) v1(95.94,36.21) v1(95.94,33.67) v1(95.94,31.13) v1(95.94,28.59) v1(95.94,23.51) v1(95.94,20.97) v1(95.94,18.43) v1(95.94,13.35) v1(95.94,10.81) v1(95.94,8.27) v1(98.48,56.53) v1(98.48,53.99) v1(98.48,51.45) v1(98.48,48.91) v1(98.48,46.37) v1(98.48,43.83) v1(98.48,41.29) v1(98.48,38.75) v1(98.48,36.21) v1(98.48,33.67) v1(98.48,31.13) v1(98.48,28.59) v1(98.48,23.51) v1(98.48,20.97) v1(98.48,18.43) v1(98.48,13.35) v1(98.48,10.81)
VBAT: length 2
  Top Layer w0.762: 79.25,19.23 79.25,17.21
VCC: length 13.4
  Top Layer w0.508: U5.1 83.14,25.48 R13.1
  Top Layer w0.762: R13.1 83.19,28.52 83.95,29.28 91.82,29.28
ADC1-1: length 52.4
  Top Layer w0.152: v1(26.04,52.52) 21.78,52.52 C39.2 ; v1(26.04,37.79) 26.13,37.7 U1.11
  Top Layer w0.254: W1.2 0.76,51.34 0.76,48.2 1.78,47.18 21.08,47.18 21.59,47.69 21.59,52.45 C39.2
  Bottom Layer w0.152: v1(26.04,37.79) v1(26.04,52.52)
ADC1-2: length 85.4
  Top Layer w0.152: v1(25.3,35.88) 25.3,36.67 25.83,37.2 U1.12 ; v1(25.27,58.87) 74.55,58.87 75.06,58.36 75.06,54.15 C41.2
  Top Layer w0.254: C41.2 78.44,52.6 W2.2
  Bottom Layer w0.152: v1(25.27,58.87) 25.3,58.84 v1(25.3,35.88)
ADC1-3: length 93.9
  Top Layer w0.152: C42.2 v1(28.96,64.39) ; v1(28.96,34.1) 29.64,34.78 U1.13
  Top Layer w0.254: W2.5 C42.2
  Bottom Layer w0.152: v1(28.96,64.39) v1(28.96,34.1)
ADC1-6: length 49.5
  Top Layer w0.152: U1.16 31.11,35.72 v1(31.11,41.22) ; C40.2 12.76,63.69 v1(31.11,63.69)
  Top Layer w0.254: W1.5 C40.2
  Bottom Layer w0.152: v1(31.11,63.69) v1(31.11,41.22)
AT1: length 5.2
  Top Layer w0.254: 44.96,87.89 C15.2 ; 44.96,87.89 44.63,88.22 NOREF.1 ; 44.96,87.89 43.18,87.89
KEY-DOWN: length 53.3
  Top Layer w0.152: v1(20.19,17.97) 15.17,17.97 SW4.2 ; 36.38,38.2 36.37,38.21 35.14,38.21 34.44,38.9 v1(34.44,38.93) ; v1(20.19,29.53) v1(30.99,29.53)
  Top Layer w0.254: R20.2 13.34,16.21 SW4.2 SW4.1
  Bottom Layer w0.152: v1(20.19,17.97) v1(20.19,29.53) ; v1(34.44,38.93) 34.3,38.93 32.39,37.02 32.39,30.8 31.11,29.53 v1(30.99,29.53)
KEY-LEFT: length 60.6
  Top Layer w0.152: SW5.2 3.95,24.32 5.59,24.32 6.1,23.82 6.1,21.91 6.86,21.15 v1(19.05,21.15) ; v1(34.67,37.91) 34.8,37.91 35.02,37.7 U1.26 ; v1(30.23,28.52) v1(19.05,28.52)
  Top Layer w0.254: R19.2 3.69,24.59 SW5.2 SW5.1
  Bottom Layer w0.152: v1(30.23,28.52) 31.11,28.52 32.77,30.17 32.77,36.38 34.3,37.91 v1(34.67,37.91) ; v1(19.05,28.52) v1(19.05,21.15)
KEY-LEFT-X: length 68.1
  Top Layer w0.152: v1(33.78,88.33) 26.12,88.33 25.74,87.95 R22.2 22.2,85.67 21.41,84.88 ; v1(33.78,42.23) 33.14,41.58 U1.20
  Bottom Layer w0.152: v1(33.78,42.23) 33.78,50.75 33.81,50.77 33.81,51.22 33.78,51.24 v1(33.78,88.33)
KEY-RIGHT: length 34.9
  Top Layer w0.152: SW6.2 23.15,26.52 23.75,27.12 32.26,27.12 ; U1.25 36.59,37.15 v1(34.29,37.15)
  Top Layer w0.254: SW6.1 SW6.2 22.99,24.28 21.54,24.28
  Bottom Layer w0.152: v1(32.39,27.12) 34.29,29.02 v1(34.29,37.15)
KEY-RIGHT-X: length 96.9
  Top Layer w0.152: v1(34.8,66.11) 78.49,66.11 80.15,67.77 SW8.2 78.82,84.69 R23.2 ; U1.21 33.64,40.56 v1(34.54,41.47)
  Bottom Layer w0.152: v1(34.8,66.11) 34.8,42.86 34.65,42.71 34.65,42.26 34.8,42.11 34.8,41.72 v1(34.54,41.47)
KEY-UP: length 38.9
  Top Layer w0.152: U1.22 34.16,35.67 34.16,34.13 v1(33.76,33.72) ; SW3.2 13.62,31.93 17.67,27.88 v1(31.5,27.88)
  Top Layer w0.254: R18.2 13.36,31.92 SW3.2 SW3.1
  Bottom Layer w0.152: v1(33.76,33.72) 33.76,30.14 v1(31.5,27.88)
NRST: length 45.5
  Top Layer w0.152: SW1.2 SW1.1 41.59,38.73 41.15,38.29 41.15,34.87 38.96,32.67 arc(38.88,32.63) 38.81,32.58 v1(31.77,32.58) ; U1.7 24.9,39.7 v1(24.77,39.56)
  Top Layer w0.254: v1(24.77,35.12) 23.49,35.12 R1.1 23.28,35.09 21.67,35.09
  Bottom Layer w0.152: v1(24.77,39.56) v1(24.77,35.12) 27.31,32.58 v1(31.77,32.58)
OLED-CLK: length 59.2
  Top Layer w0.152: U1.15 30.64,30.65 31.01,30.27 v1(35.18,30.27) ; R16.2 54.23,53.42 53.85,53.04 v1(53.85,49.51) 53.85,46.7 53.82,46.68
  Bottom Layer w0.152: v1(35.18,30.27) 35.18,37.67 38.09,40.58 54.08,40.58 54.23,40.73 54.23,49.13 v1(53.85,49.51)
OLED-CS: length 39.4
  Top Layer w0.152: v1(29.85,51.25) 47.88,51.25 50.32,48.81 50.32,46.68 ; v1(29.72,42.61) 29.72,37.41 30.14,36.99 U1.14
  Bottom Layer w0.152: v1(29.85,51.25) 29.85,42.74 v1(29.72,42.61)
OLED-D/C: length 40.7
  Top Layer w0.152: v1(32.6,41.32) 32.64,41.28 32.64,35.7 U1.19 ; 51.72,46.68 51.72,50.33 49.53,52.52 32.77,52.52 v1(32.64,52.65)
  Bottom Layer w0.152: v1(32.64,52.65) 32.6,52.61 v1(32.6,41.32)
OLED-DIN: length 59.7
  Top Layer w0.152: 54.52,46.68 54.48,46.71 v1(54.48,50.41) 54.48,51.88 54.99,52.39 60.7,52.39 R17.2 ; v1(36.07,30.93) 31.62,30.93 31.24,31.31 31.24,34.67 31.63,35.06 31.63,35.69 U1.17
  Bottom Layer w0.152: v1(54.48,50.41) 54.86,50.02 54.86,40.23 54.71,40.07 38.23,40.07 36.07,37.91 v1(36.07,30.93)
OLED-RES: length 39.5
  Top Layer w0.152: v1(31.88,51.99) 48.62,51.99 51.02,49.6 51.02,46.68 ; v1(32,42.08) 32,37.28 32.14,37.15 U1.18
  Bottom Layer w0.152: v1(32,42.08) 32,51.87 v1(31.88,51.99)
OSC_IN: length 10.7
  Top Layer w0.254: X1.1 22.23,42.06 ; 22.23,42.06 C3.1 ; 22.23,42.06 22.23,42.36 22.99,43.12 24.89,43.12 25.07,42.94 25.07,41.42 25.79,40.7 U1.5
OSC_OUT: length 11.2
  Top Layer w0.254: X1.3 18.82,39.44 22.8,39.44 C2.2 24.45,40.52 24.77,40.2 28.13,40.2 U1.6
PA9: length 65.1
  Top Layer w0.152: U1.30 38.1,39.7 38.35,39.95 63.75,39.95 v1(63.76,39.96) ; CN1.6 94.36,35.53 v1(94.36,39.83)
  Bottom Layer w0.152: v1(63.76,39.96) 94.23,39.96 v1(94.36,39.83)
PA10: length 62.6
  Top Layer w0.152: U1.31 37.97,40.2 38.35,40.58 64.9,40.58 ; v1(92.71,40.58) 93.73,39.56 93.73,36.26 92.95,35.48 CN1.4
  Bottom Layer w0.152: v1(92.71,40.58) 92.71,40.58 v1(65.02,40.58)
PA13: length 60.2
  Top Layer w0.152: v1(87.4,41.72) 87.4,35.98 87.9,35.48 CN1.3 ; U1.34 37.37,41.7 38.1,40.96 64.26,40.96 v1(65.02,41.72)
  Bottom Layer w0.152: v1(87.4,41.72) v1(65.02,41.72)
PA14: length 65.6
  Top Layer w0.152: U1.37 35.14,42.53 v1(35.18,42.49) ; v1(65.79,42.49) v1(40.89,42.49) ; CN1.5 87.23,33.48 86.74,33.98 v1(86.74,42.49)
  Bottom Layer w0.152: v1(86.74,42.49) v1(65.79,42.49) ; v1(40.89,42.49) v1(35.18,42.49)
PA15: length 48.5
  Top Layer w0.152: U3.2 47.5,80.69 47.5,75.51 46.99,75 v1(39.37,75) ; v1(39.37,46.93) 35.65,46.93 34.64,45.91 U1.38
  Bottom Layer w0.152: v1(39.37,46.93) v1(39.37,75)
PB3: length 48.9
  Top Layer w0.152: U3.3 47.97,74.58 47.24,73.85 v1(38.61,73.85) ; v1(38.61,47.57) 35.93,47.57 34.27,45.91 34.27,44.33 U1.39
  Bottom Layer w0.152: v1(38.61,47.57) v1(38.61,73.85)
PB4: length 50.1
  Top Layer w0.152: U3.5 49.02,80.66 49.02,72.58 48.26,71.82 v1(37.85,71.82) ; v1(37.85,48.33) 36.07,48.33 33.64,45.89 U1.40
  Bottom Layer w0.152: v1(37.85,48.33) v1(37.85,71.82)
PB5: length 49.7
  Top Layer w0.152: v1(37.21,48.96) 37.08,48.84 35.55,48.84 33.14,46.42 U1.41 ; U3.4 48.47,74.06 47.24,72.84 v1(37.21,72.84)
  Bottom Layer w0.152: v1(37.21,48.96) v1(37.21,72.84)
PB6: length 52.5
  Top Layer w0.152: 36.32,49.47 35.56,49.47 32.64,46.55 32.64,44.2 U1.42 ; U3.6 50.04,81.65 50.04,71.57 49.02,70.55 v1(36.45,70.55)
  Bottom Layer w0.152: v1(36.45,49.47) v1(36.45,70.55)
PB7: length 49.1
  Top Layer w0.152: U3.1 46.99,80.7 46.99,76.65 46.36,76.01 35.94,76.01 v1(35.81,75.89) ; v1(35.81,50.11) 35.31,50.11 32.14,46.93 U1.43
  Bottom Layer w0.152: v1(35.81,50.11) v1(35.81,75.89)
PB15: length 88.3
  Top Layer w0.152: v1(75.18,21.66) 75.18,20.27 R14.2 ; v1(65.79,39.31) 65.67,39.43 54.3,39.43 54.28,39.44 38.08,39.44 37.42,38.78 36.72,38.78 U1.28
  Top Layer w0.254: 88.33,7.24 84.13,7.24 83.94,7.43 74.68,7.43 72.34,9.77 72.34,19.95 72.52,20.13 R14.2
  Bottom Layer w0.152: v1(65.79,39.31) 65.91,39.44 74.68,39.44 75.18,38.93 v1(75.18,21.66)
XI: length 10.5
  Top Layer w0.254: 58.99,84.13 58.99,84.21 58.17,85.03 56.32,85.03 C20.1 55.32,84.13 54.78,84.13 54.22,84.69 53.09,84.69 52.53,84.13 52.07,84.13 51.66,83.72 U3.10
XO: length 8.1
  Top Layer w0.254: U3.9 50.45,83.22 51.05,82.62 52.06,82.62 52.07,82.63 53.64,82.63 C21.2 54.54,81.73 56.19,81.73 X2.3
$1N1208: length 8.9
  Top Layer w0.152: 26.28,47.31 26.28,47.57 26.53,47.82 30.86,47.82 31.64,47.05 U1.44
$2N785: length 2.1
  Top Layer w0.254: L4.1 80.52,18.1 U5.7
$2N788: length 1.2
  Top Layer w0.254: R14.1 77.96,20.13 U5.5
$2N793: length 26.3
  Top Layer w0.254: v1(76.33,25.47) 77.96,25.47 U5.4 ; v1(75.57,10.61) 76.68,10.61 LED5.2 79.01,10.58 LED6.1 81.94,10.35 LED7.2 84.48,10.58 LED8.1
  Bottom Layer w0.254: v1(76.33,25.47) 76.33,11.37 v1(75.57,10.61)
$2N794: length 23.8
  Top Layer w0.254: v1(78.99,13.53) 81.79,13.53 82.17,13.15 LED7.1 84.48,11.65 LED8.2 ; v1(79.12,27.63) 79.12,25.61 U5.3
  Bottom Layer w0.254: v1(78.99,13.53) 78.99,27.5 v1(79.12,27.63)
$2N795: length 21
  Top Layer w0.254: v1(80.52,27.25) U5.2 ; LED5.1 79.01,11.65 LED6.2 79.68,11.42 v1(80.52,12.26)
  Bottom Layer w0.254: v1(80.52,12.26) v1(80.52,27.25)
$2N798: length 1.7
  Top Layer w0.254: C25.1 84.82,24.02 R13.2
$3N853: length 4
  Top Layer w0.152: U3.12 48.47,85.41 49.12,86.07 49.12,86.46 47.98,87.6 47.98,87.99
$3N854: length 10.9
  Top Layer w0.152: U3.11 50.36,84.72 51.18,85.54 53.09,85.54 53.09,87.82 52.83,88.08 52.26,88.08 C18.2
  Top Layer w0.254: C18.2 C17.2 50.65,87.99 49.12,87.99
$3N855: length 4
  Top Layer w0.152: 47.98,86.59 47.98,84.73 U3.13
  Top Layer w0.254: L2.2 46.48,87.76 L1.1
$3N877: length 4.8
  Top Layer w0.152: U3.16 45.92,83.76 43.43,83.76 42.02,85.17 R7.1
$3N878: length 6.2
  Top Layer w0.152: C19.2 43.49,79.88 43.82,80.2 43.82,81.86 44.18,82.22 U3.19
$3N883: length 1.3
  Top Layer w0.254: L1.2 C15.1
$4N420: length 9.9
  Top Layer w0.152: 42.62,46.68 42.62,48.25 41.78,49.09 v1(41.15,49.09) ; v1(40.77,53.66) 40.07,54.36 40.07,55.19
  Bottom Layer w0.152: v1(40.77,53.66) 40.77,49.47 v1(41.15,49.09)
$4N424: length 9.3
  Top Layer w0.152: C30.1 42.55,54.11 v1(42.55,53.79) ; v1(42.67,49.57) 42.8,49.45 42.8,48.58 43.32,48.06 43.32,46.68
  Bottom Layer w0.152: v1(42.67,49.57) 42.67,53.66 v1(42.55,53.79)
$4N430: length 8.8
  Top Layer w0.152: 44.02,46.68 44.02,49.24 v1(43.94,49.32) ; v1(43.56,53.53) 43.56,54.87 C31.1
  Bottom Layer w0.152: v1(43.94,49.32) 43.94,53.15 v1(43.56,53.53)
$4N436: length 8.5
  Top Layer w0.152: C31.2 44.7,55.12 v1(44.7,53.41) ; v1(44.7,48.45) 44.7,46.69 44.72,46.68
  Bottom Layer w0.152: v1(44.7,53.41) v1(44.7,48.45)
$4N747: length 9.9
  Top Layer w0.152: 59.42,46.68 59.31,46.79 59.31,50.87 59.94,51.5 62.36,51.5 63.5,52.65 R15.2
$4N851: length 10.6
  Top Layer w0.152: 60.12,46.68 60.07,46.73 60.07,50.36 60.58,50.87 63.5,50.87 65.15,52.52 C32.2
$4N925: length 11.3
  Top Layer w0.152: 60.82,46.68 60.83,46.69 60.83,49.98 61.34,50.49 64.77,50.49 66.77,52.49 C33.2

## Copper pours and planes (outline as drawn; the poured copper is in the pictures)
3V3 on Top Layer: 42.8,79.41 44.94,79.41 44.94,77.92 42.8,77.92
3V3 on Top Layer: 26.86,83.7 29.85,83.7 29.85,81.86 26.86,81.86
3V3 on Top Layer: 22.8,38.89 24.26,38.89 24.26,36.01 22.8,36.01
3V3 on Top Layer: 55.75,79.79 58.8,79.79 58.8,77.51 55.75,77.51
3V3 on Top Layer: 69.72,42.23 72.14,42.23 72.14,30.8 69.72,30.8
3V3 on Top Layer: 8.64,31.06 10.16,31.06 10.16,30.04 8.64,30.04
3V3 on Top Layer: 42.8,83.38 44.83,83.38 44.83,82.7 42.8,82.7
3V3 on Top Layer: 55.75,37.75 72.14,37.75 72.14,35.88 55.75,35.88
3V3 on Top Layer: 40.51,45.03 58.81,45.03 58.81,43.12 40.51,43.12
3V3 on Bottom Layer: 42.8,85.16 44.83,85.16 44.83,77.79 42.8,77.79
3V3 on Bottom Layer: 13.92,37.96 24.38,37.96 24.38,36.01 13.92,36.01
3V3 on Bottom Layer: 26.86,83.7 29.85,83.7 29.85,69.66 26.86,69.66
3V3 on Bottom Layer: 38.38,37.75 58.66,37.75 58.66,36.58 38.38,36.58
3V3 on Bottom Layer: 55.75,79.95 58.8,79.95 58.8,35.94 55.75,35.94
3V3 on Bottom Layer: 42.8,79.44 58.8,79.44 58.8,77.79 42.8,77.79
3V3 on Bottom Layer: 13.72,72.2 29.85,72.2 29.85,69.66 13.72,69.66
3V3 on Bottom Layer: 15.44,72.2 16.26,72.2 16.26,18.36 15.44,18.36
3V3A on Top Layer: 69.75,48.66 72.19,48.66 72.19,42.73 69.75,42.73
3V3A on Top Layer: 21.64,61.92 72.26,61.92 72.26,59.88 21.64,59.88
3V3A on Top Layer: 9.65,58.61 11.94,58.61 11.94,56.58 9.65,56.58
3V3A on Bottom Layer: 69.72,62.68 72.19,62.68 72.19,46.68 69.72,46.68
+5V on Top Layer: 73.28,34.1 83.41,34.1 83.41,32.76 73.28,32.76
+5V on Top Layer: 81.29,20.97 83.44,20.97 83.44,19.24 81.29,19.24
+5V on Bottom Layer: 81.29,34.1 83.44,34.1 83.44,19.24 81.29,19.24
GND on Top Layer: -3.94,99.38 107.32,99.38 107.32,-2.73 -3.94,-2.73
GND on Bottom Layer: -1.91,105.6 105.92,105.6 105.92,-4 -1.91,-4
VBAT on Top Layer: 88.13,20.61 91.69,20.61 91.69,16.17 88.13,16.17
VBAT on Top Layer: 78.74,17.21 91.69,17.21 91.69,16.2 78.74,16.2
VCC on Top Layer: 91.44,32.33 93.22,32.33 93.22,28.52 91.44,28.52
AT1 on Top Layer: 42.06,96.19 56.49,96.19 56.49,90.77 42.06,90.77

Small or netless copper shapes (teardrops, artwork), in the pictures only: 264 on Top Layer, 71 on Bottom Layer

## Text on the board
Top Silkscreen Layer: 无人机遥控器
